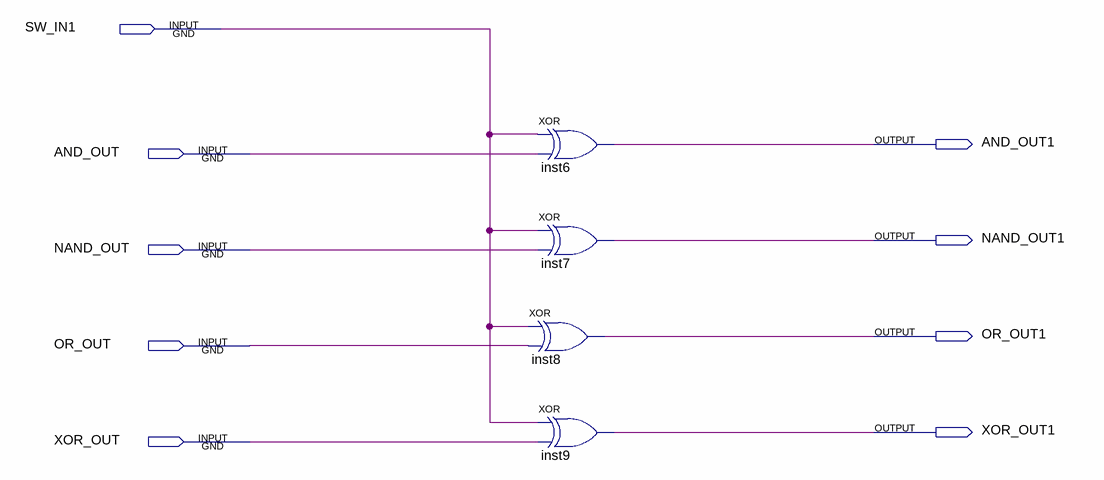
[diagram p0: schematic sheet]
// Quartus schematic Schematic_Polarity_Controller.bdf as structural Verilog: 4 symbols, 9 pins
module Schematic_Polarity_Controller (
  input  SW_IN1,
  input  AND_OUT,
  input  NAND_OUT,
  input  OR_OUT,
  input  XOR_OUT,
  output AND_OUT1,
  output NAND_OUT1,
  output OR_OUT1,
  output XOR_OUT1
);

  xor inst6 (AND_OUT1, SW_IN1, AND_OUT);
  xor inst7 (NAND_OUT1, SW_IN1, NAND_OUT);
  xor inst8 (OR_OUT1, SW_IN1, OR_OUT);
  xor inst9 (XOR_OUT1, SW_IN1, XOR_OUT);
endmodule
